# Altium schematic sheet S02_Block_Diagram.SchDoc
size A4
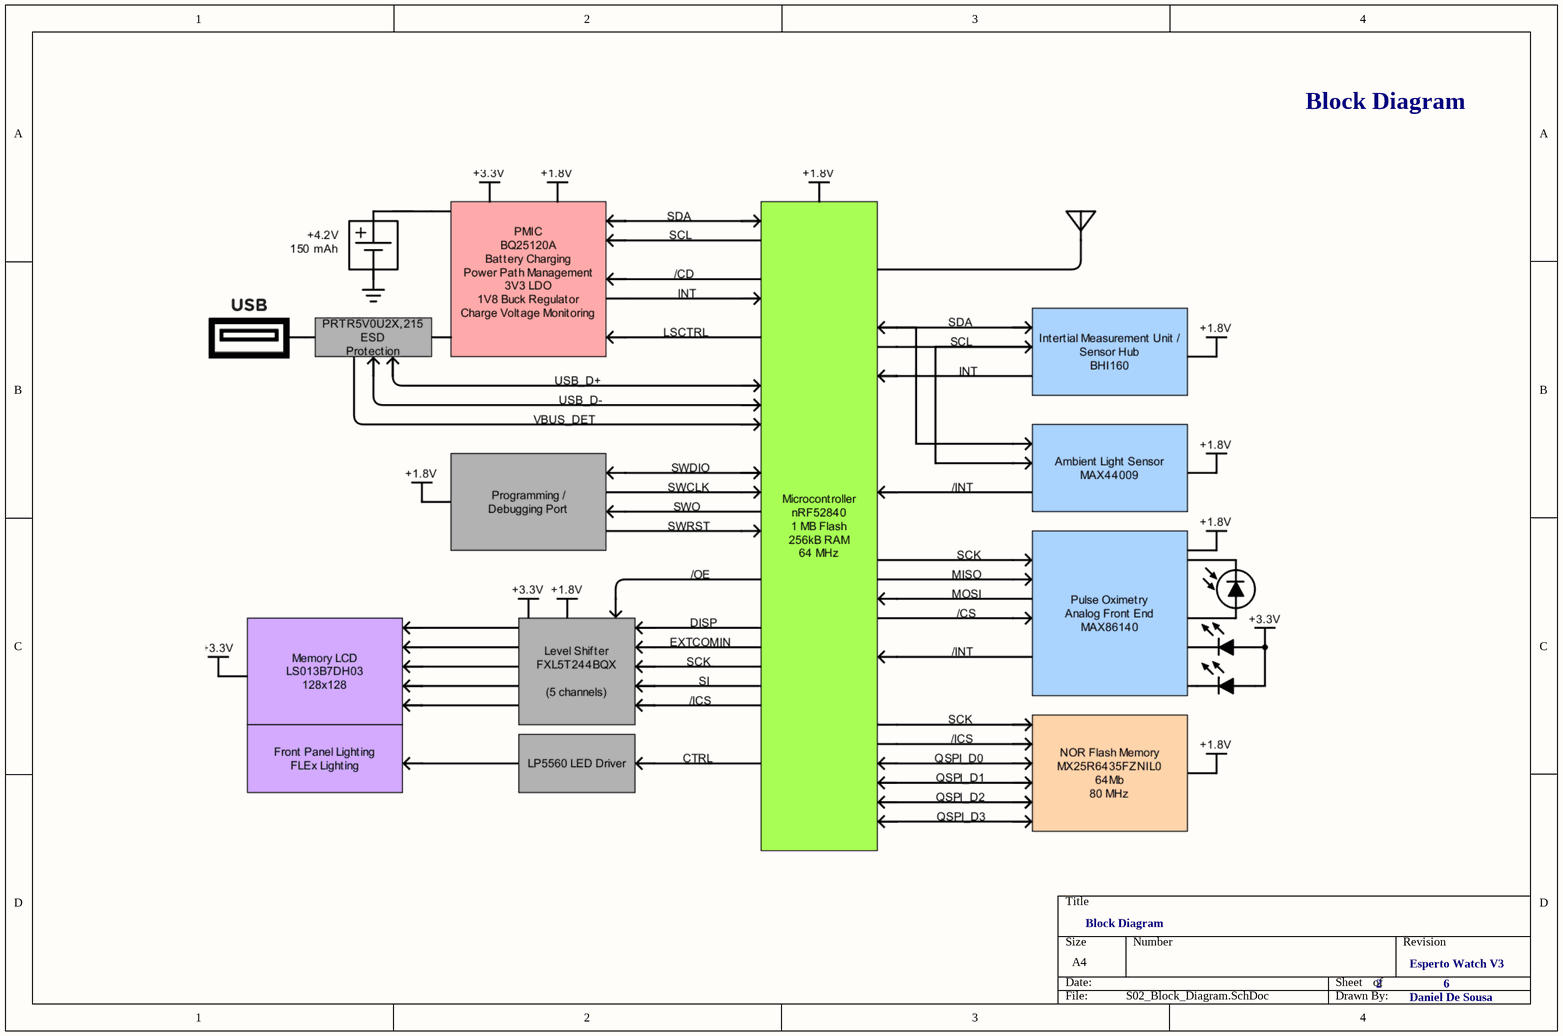
[diagram p0: S02_Block_Diagram.SchDoc]

## Notes on the sheet
- Block Diagram
- 2
- Esperto Watch V3
- 6
- Daniel De Sousa